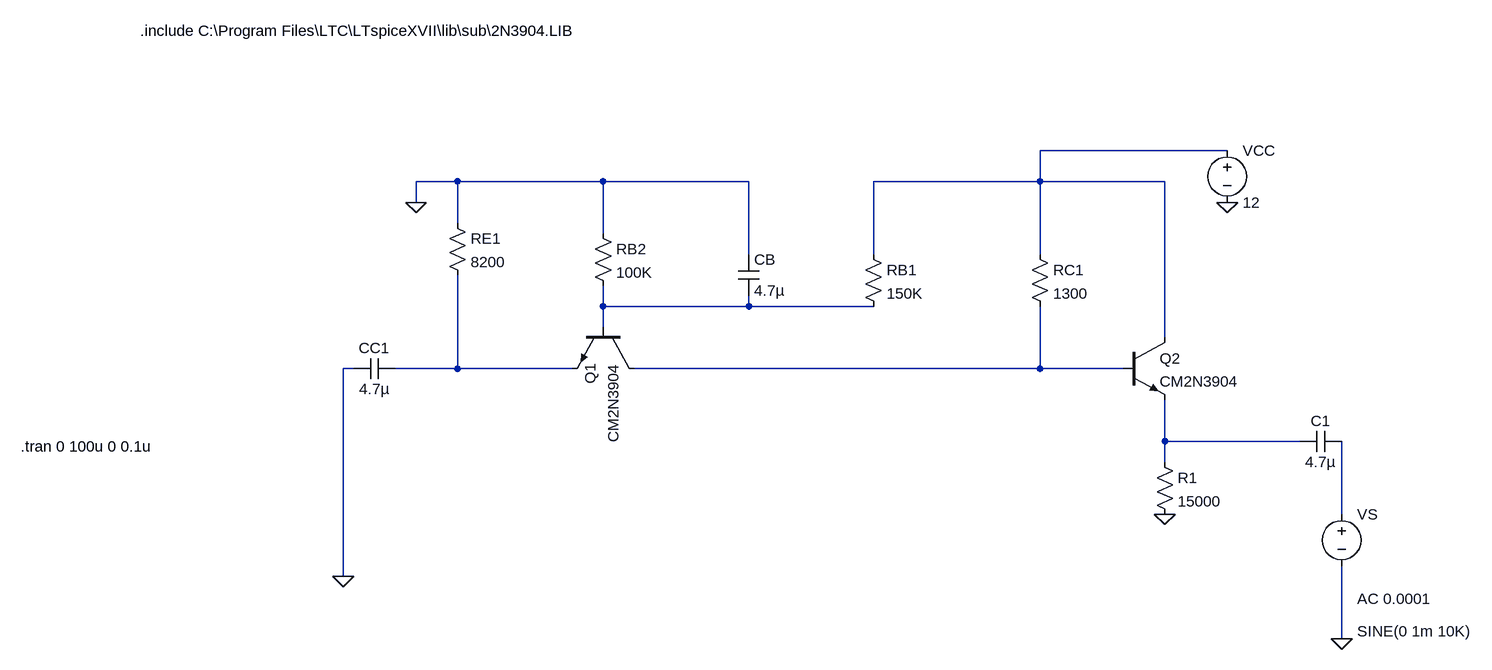
[diagram p0: schematic Part 2 circuit output resistance.asc]
Part 2 circuit output resistance.asc, the LTspice schematic file:
Version 4
SHEET 1 2364 996
WIRE 1616 208 1328 208
WIRE 432 256 368 256
WIRE 656 256 432 256
WIRE 880 256 656 256
WIRE 1328 256 1328 208
WIRE 1328 256 1072 256
WIRE 1520 256 1328 256
WIRE 368 288 368 256
WIRE 432 320 432 256
WIRE 656 336 656 256
WIRE 880 368 880 256
WIRE 1072 368 1072 256
WIRE 1328 368 1328 256
WIRE 656 448 656 416
WIRE 880 448 880 432
WIRE 880 448 656 448
WIRE 1072 448 880 448
WIRE 656 480 656 448
WIRE 1520 496 1520 256
WIRE 272 544 256 544
WIRE 432 544 432 400
WIRE 432 544 336 544
WIRE 608 544 432 544
WIRE 1328 544 1328 448
WIRE 1328 544 704 544
WIRE 1456 544 1328 544
WIRE 1520 656 1520 592
WIRE 1728 656 1520 656
WIRE 1520 688 1520 656
WIRE 1792 768 1792 656
WIRE 256 864 256 544
WIRE 1792 960 1792 848
FLAG 368 288 0
FLAG 1520 768 0
FLAG 1616 288 0
FLAG 1792 960 0
FLAG 256 864 0
SYMBOL cap 336 528 R90
WINDOW 0 0 32 VBottom 2
WINDOW 3 32 32 VTop 2
SYMATTR InstName CC1
SYMATTR Value 4.7µ
SYMBOL res 416 304 R0
SYMATTR InstName RE1
SYMATTR Value 8200
SYMBOL res 640 320 R0
SYMATTR InstName RB2
SYMATTR Value 100K
SYMBOL cap 864 368 R0
SYMATTR InstName CB
SYMATTR Value 4.7µ
SYMBOL npn 704 480 R90
SYMATTR InstName CM2N3904
SYMATTR Value Q1
SYMBOL res 1056 352 R0
SYMATTR InstName RB1
SYMATTR Value 150K
SYMBOL res 1312 352 R0
SYMATTR InstName RC1
SYMATTR Value 1300
SYMBOL npn 1456 496 R0
SYMATTR InstName Q2
SYMATTR Value CM2N3904
SYMBOL cap 1792 640 R90
WINDOW 0 0 32 VBottom 2
WINDOW 3 32 32 VTop 2
SYMATTR InstName C1
SYMATTR Value 4.7µ
SYMBOL voltage 1616 192 R0
SYMATTR InstName VCC
SYMATTR Value 12
SYMBOL voltage 1792 752 R0
WINDOW 3 24 196 Left 2
WINDOW 123 24 146 Left 2
WINDOW 39 0 0 Left 0
SYMATTR Value SINE(0 1m 10K)
SYMATTR Value2 AC 0.0001
SYMATTR InstName VS
SYMBOL res 1504 672 R0
SYMATTR InstName R1
SYMATTR Value 15000
TEXT -56 24 Left 2 !.include C:\\Program Files\\LTC\\LTspiceXVII\\lib\\sub\\2N3904.LIB
TEXT -240 664 Left 2 !.tran 0 100u 0 0.1u

The netlist it stands for:
* Part 2 circuit output resistance.asc
CC1 N003 0 4.7µ
RE1 0 N003 8200
RB2 0 N002 100K
CB 0 N002 4.7µ
Q§CM2N3904 N004 N002 N003 0 Q1
RB1 N001 N002 150K
RC1 N001 N004 1300
Q2 N001 N004 N005 0 CM2N3904
C1 N006 N005 4.7µ
VCC N001 0 12
VS N006 0 SINE(0 1m 10K) AC 0.0001
R1 N005 0 15000
.model NPN NPN
.model PNP PNP
.lib standard.bjt
.include C:\Program Files\LTC\LTspiceXVII\lib\sub\2N3904.LIB
.tran 0 100u 0 0.1u
.backanno
.end